# Altium project Stm32F407MCU.PrjPCB
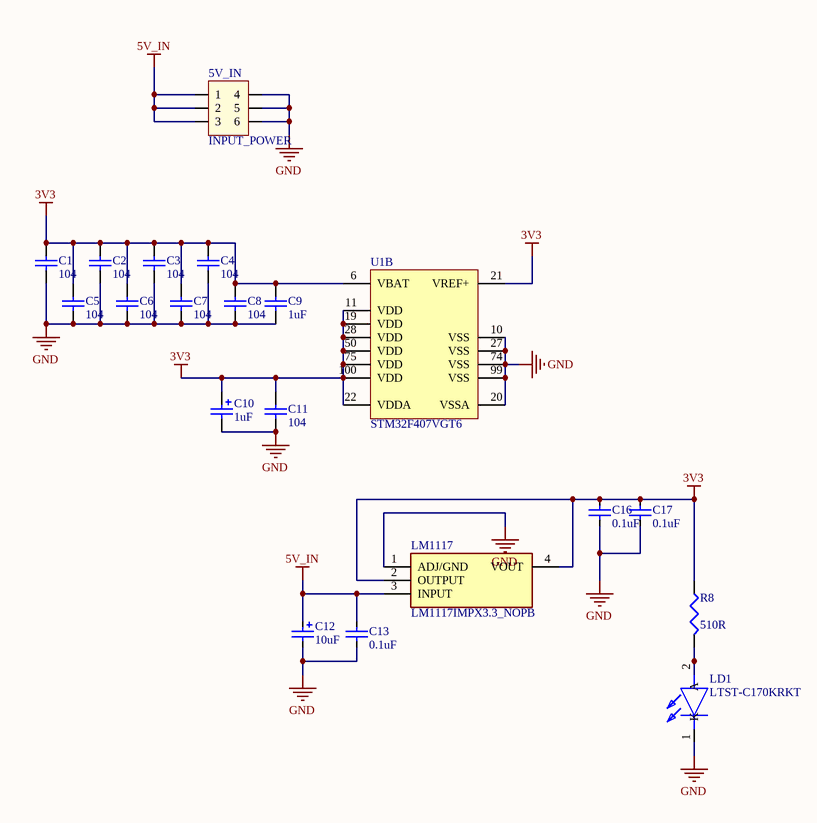
[diagram p0: power.SchDoc]
6 sheets, 67 parts. Net scope: global (net labels, ports and power ports of the same name join across sheets).
Board file: stm32f407_copter.PcbDoc
Sheets:
  power.SchDoc
  Pinout.SchDoc
  STM32F407VGT6.SchDoc
  user.SchDoc
  SENSORS.SchDoc
  design_note.SchDoc

## Sheet power.SchDoc
size A

### Parts
5V_IN  INPUT_POWER  [JP3x2]
C1  104  [CAPC2012X98N]
C2  104  [CAPC2012X98N]
C3  104  [CAPC2012X98N]
C4  104  [CAPC2012X98N]
C5  104  [CAPC2012X98N]
C6  104  [CAPC2012X98N]
C7  104  [CAPC2012X98N]
C8  104  [CAPC2012X98N]
C9  1uF  [CAPC1608X90N]
C10  1uF  [CAPPM3216X180N]
C11  104  [CAPC2012X98N]
C12  10uF  [CAPPM3528X210N]
C13  value 0.1uF  [CAPC3216X135N]  (hidden comment: Cap_0603)
C16  value 0.1uF  [CAPC3216X135N]  (hidden comment: Cap_0603)
C17  value 0.1uF  [CAPC3216X135N]  (hidden comment: Cap_0603)
LD1  LTST-C170KRKT  [LEDC2012X120N]
LM1117  LM1117IMPX3.3_NOPB  [SOT230P700X180-4N]
R8  value 510R  [RESC1608X55N]
U1  STM32F407VGT6  [STM-LQFP100_N]  (part B of 2)

### Nets
3V3: C1.1 C2.1 C3.1 C4.1 C5.1 C6.1 C7.1 C8.1 C9.2 C10.1 C11.1 C16.2 C17.2 LM1117.2(OUTPUT) LM1117.4(VOUT) R8.1 U1.6(VBAT) U1.11(VDD) U1.19(VDD) U1.21(VREF+) U1.22(VDDA) U1.28(VDD) U1.50(VDD) U1.75(VDD) U1.100(VDD)
5V_IN: 5V_IN.1 5V_IN.2 5V_IN.3 C12.1 C13.2 LM1117.3(INPUT)
GND: 5V_IN.4 5V_IN.5 5V_IN.6 C1.2 C2.2 C3.2 C4.2 C5.2 C6.2 C7.2 C8.2 C9.1 C10.2 C11.2 C12.2 C13.1 C16.1 C17.1 LD1.1(K) LM1117.1(ADJ/GND) U1.10(VSS) U1.20(VSSA) U1.27(VSS) U1.74(VSS) U1.99(VSS)
NetLD1_2: LD1.2(A) R8.2

### Library data of the parts
5V_IN = JP3x2: Connector 3x2; Value: Connector 3x2
C1 = Cap Semi: Capacitor (Semiconductor SIM Model); Component Code: C0805X104K5RAC3316; LatestRevisionDate: 17-Jul-2002; LatestRevisionNote: Re-released for DXP Platform.; PackageReference: C1206; Publisher: Altium Limited; Value: 104
C2-C8 C11 = Cap Semi: Capacitor (Semiconductor SIM Model); LatestRevisionDate: 17-Jul-2002; LatestRevisionNote: Re-released for DXP Platform.; PackageReference: C1206; Publisher: Altium Limited; Value: 104
C9 = Cap Semi: Capacitor (Semiconductor SIM Model); Value: 104; Component Code: CC0603KRX5R7BB105; LatestRevisionDate: 17-Jul-2002; LatestRevisionNote: Re-released for DXP Platform.; PackageReference: C1206; Publisher: Altium Limited
C10 = Cap Pol2: Polarized Capacitor (Axial); Published: 8-Jun-2000; LatestRevisionDate: 17-Jul-2002; LatestRevisionNote: Re-released for DXP Platform.; PackageReference: POLAR0.8; Publisher: Altium Limited; PackageDescription: Polarized Capacitor; 2 Leads; Value: 1uF
C12 = Cap_Tan_1210: Tantalum Capacitor; Value: 10uF
C13 C16 C17 = Cap_0603: Capacitor
LD1 = LTST-C171GKT: LED; Manufacturer_Name: Lite-On; Datasheet Link: https://media.digikey.com/pdf/Data%20Sheets/Lite-On%20PDFs/LTST-C171GKT.pdf; Height: 0.9mm; Manufacturer_Part_Number: LTST-C171GKT; Mouser Part Number: 859-LTST-C171GKT; Mouser Price/Stock: https://www.mouser.com/Search/Refine.aspx?Keyword=859-LTST-C171GKT; RS Part Number: 6920935P; RS Price/Stock: http://uk.rs-online.com/web/p/products/6920935P
LM1117 = LM1117IMPX3.3_NOPB: Integrated Circuit; Manufacturer_Name: Texas Instruments; Manufacturer_Part_Number: LM1117IMPX3.3/NOPB; Datasheet Link: http://www.ti.com/lit/ds/symlink/lm1117.pdf; Height: 1.8mm
R8 = Res3: Resistor; Published: 8-Jun-2000; LatestRevisionDate: 29-May-2009; LatestRevisionNote: IPC-7351 Footprint Added.; PackageReference: J1-0603; Publisher: Altium Limited; PackageDescription: Chip Resistor
U1 = STM32F407VGT6: ARM Cortex-M4 32-bit MCU+FPU, 210 DMIPS, 1024 kB Flash, 192 kB Internal RAM, 82 I/Os, 100-pin LQFP, -40 to 85 degC, Tray; Manufacturer: STMicroelectronics; D/A Converter: 2x12-bit; FLASH Size (Prog) (kB): 1024; I/Os (High Current): 82; Internal RAM Size (kB): 192; Operating Frequency(F) (Processor speed) (MHz): 168; Supply Voltage(Vcc) max (V): 3.6; Supply Voltage(Vcc) min (V): 1.8; DatasheetVersion: Rev. 4; PackageVersion: Rev. 1, 06/2013; PackageReference: LQFP100; PackageDescription: 100-Pin Low Profile Quad Flat Package, 14 x 14 mm Body, 0.5 mm Pitch; Supplier 1: Digi-Key; Supplier Part Number 1: 497-11605-ND; Supplier 2: Farnell; Supplier Part Number 2: 2064368; Supplier 3: Newark; Supplier Part Number 3: 73T2333; Supplier 4: Mouser; Supplier Part Number 4: 511-STM32F407VGT6; Core: ARM Cortex-M4; Packing: Tray; Mounting Technology: Surface Mount; PartNumber: STM32F407VGT6; ComponentLink1Description: Manufacturer URL; ComponentLink1URL: http://www.st.com/web/en/home.html; ComponentLink2Description: Datasheet; ComponentLink2URL: http://www.st.com/st-web-ui/static/active/en/resource/technical/document/datasheet/DM00037051.pdf; ComponentLink3Description: Package Specification; ComponentLink3URL: http://www.st.com/st-web-ui/static/active/en/resource/technical/document/data_brief/DM00071938.pdf

## Sheet Pinout.SchDoc
size A; PageSetup: Record=PageOptions|CenterHorizontal=True|CenterVertical=True|PrintScale=1.12|XCorrection=1.00|YCorrection=1.00|PrintKind=0|BorderSize=5000000|LeftOffset=0|BottomOffset=0|Orientation=2|PaperLength=1000|PaperWidth=1000|Scale=100|PaperSource=7|PrintQuality=-3|MediaType=1|DitherType=10|PrintScaleMode=1|PaperKind=Letter|PaperIndex=1
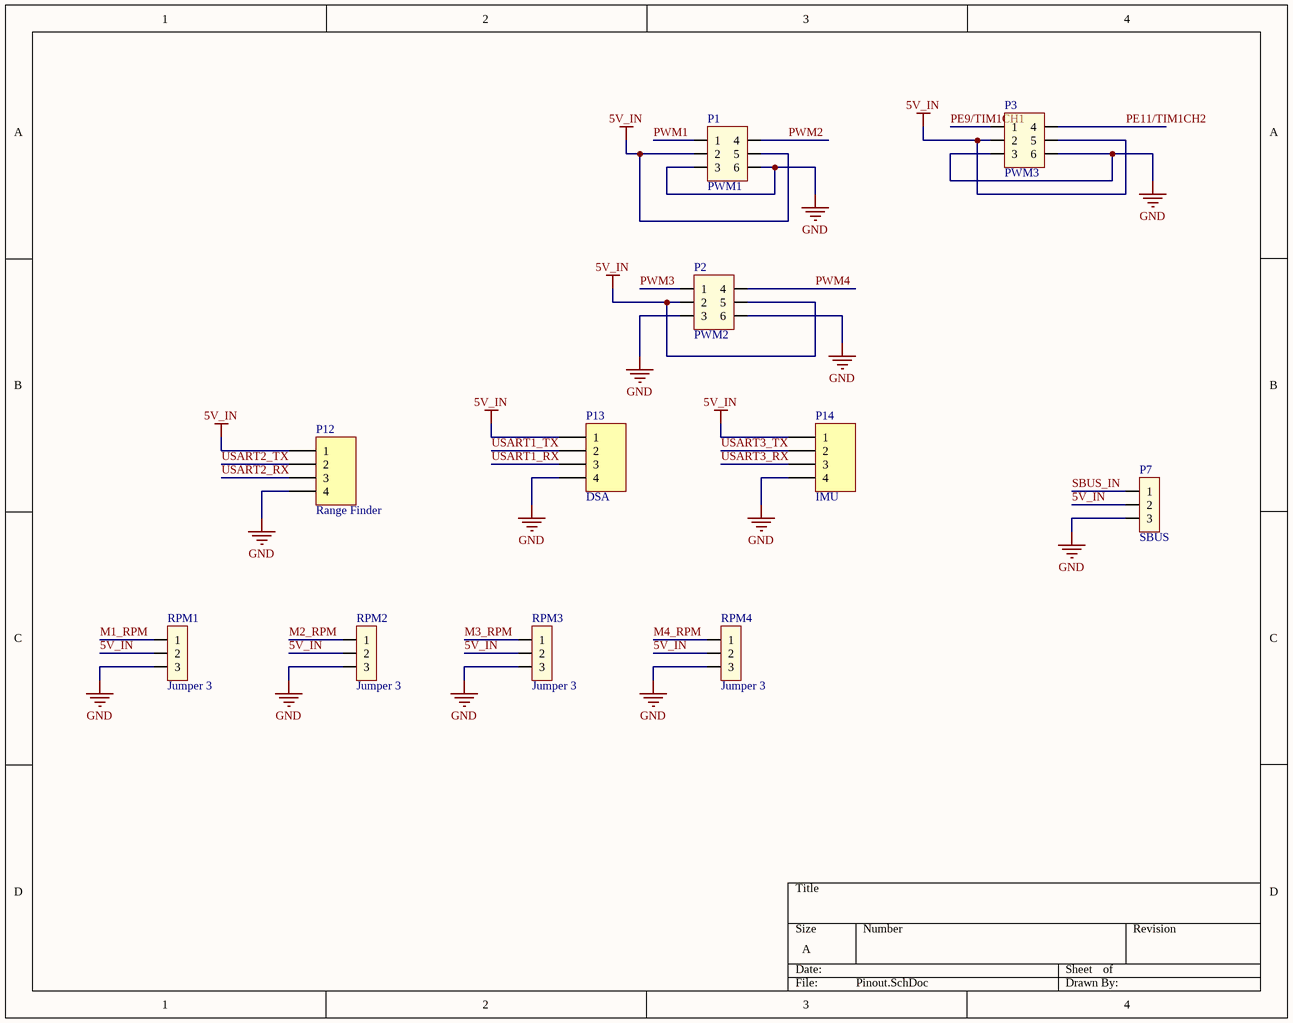
[diagram p1: Pinout.SchDoc]

### Parts
P1  PWM1  [JP3x2]
P2  PWM2  [JP3x2]
P3  PWM3  [JP3x2]
P7  SBUS  [JP3]
P12  Range Finder  [HDR1X4]
P13  DSA  [HDR1X4]
P14  IMU  [HDR1X4]
RPM1  Jumper 3  [JP3]
RPM2  Jumper 3  [JP3]
RPM3  Jumper 3  [JP3]
RPM4  Jumper 3  [JP3]

### Nets
5V_IN: P1.2 P1.5 P2.2 P2.5 P3.2 P3.5 P7.2 P12.1 P13.1 P14.1 RPM1.2 RPM2.2 RPM3.2 RPM4.2
GND: P1.3 P1.6 P2.3 P2.6 P3.3 P3.6 P7.3 P12.4 P13.4 P14.4 RPM1.3 RPM2.3 RPM3.3 RPM4.3
M1_RPM: RPM1.1
M2_RPM: RPM2.1
M3_RPM: RPM3.1
M4_RPM: RPM4.1
PE9/TIM1CH1: P3.1
PE11/TIM1CH2: P3.4
PWM1: P1.1
PWM2: P1.4
PWM3: P2.1
PWM4: P2.4
SBUS_IN: P7.1
USART1_RX: P13.3
USART1_TX: P13.2
USART2_RX: P12.3
USART2_TX: P12.2
USART3_RX: P14.3
USART3_TX: P14.2

### Library data of the parts
P1-P3 = JP3x2: Connector 3x2; Value: Connector 3x2
P7 = JP3: Jumper 3; Value: J3
P12-P14 = Header 4: Header, 4-Pin; LatestRevisionDate: 17-Jul-2002; LatestRevisionNote: Re-released for DXP Platform.; Publisher: Altium Limited
RPM1-RPM4 = JP3: Value: J3

## Sheet STM32F407VGT6.SchDoc
size A; PageSetup: Record=PageOptions|CenterHorizontal=True|CenterVertical=True|PrintScale=1.12|XCorrection=1.00|YCorrection=1.00|PrintKind=0|BorderSize=5000000|LeftOffset=0|BottomOffset=0|Orientation=2|PaperLength=1000|PaperWidth=1000|Scale=100|PaperSource=7|PrintQuality=-3|MediaType=1|DitherType=10|PrintScaleMode=1|PaperKind=Letter|PaperIndex=1
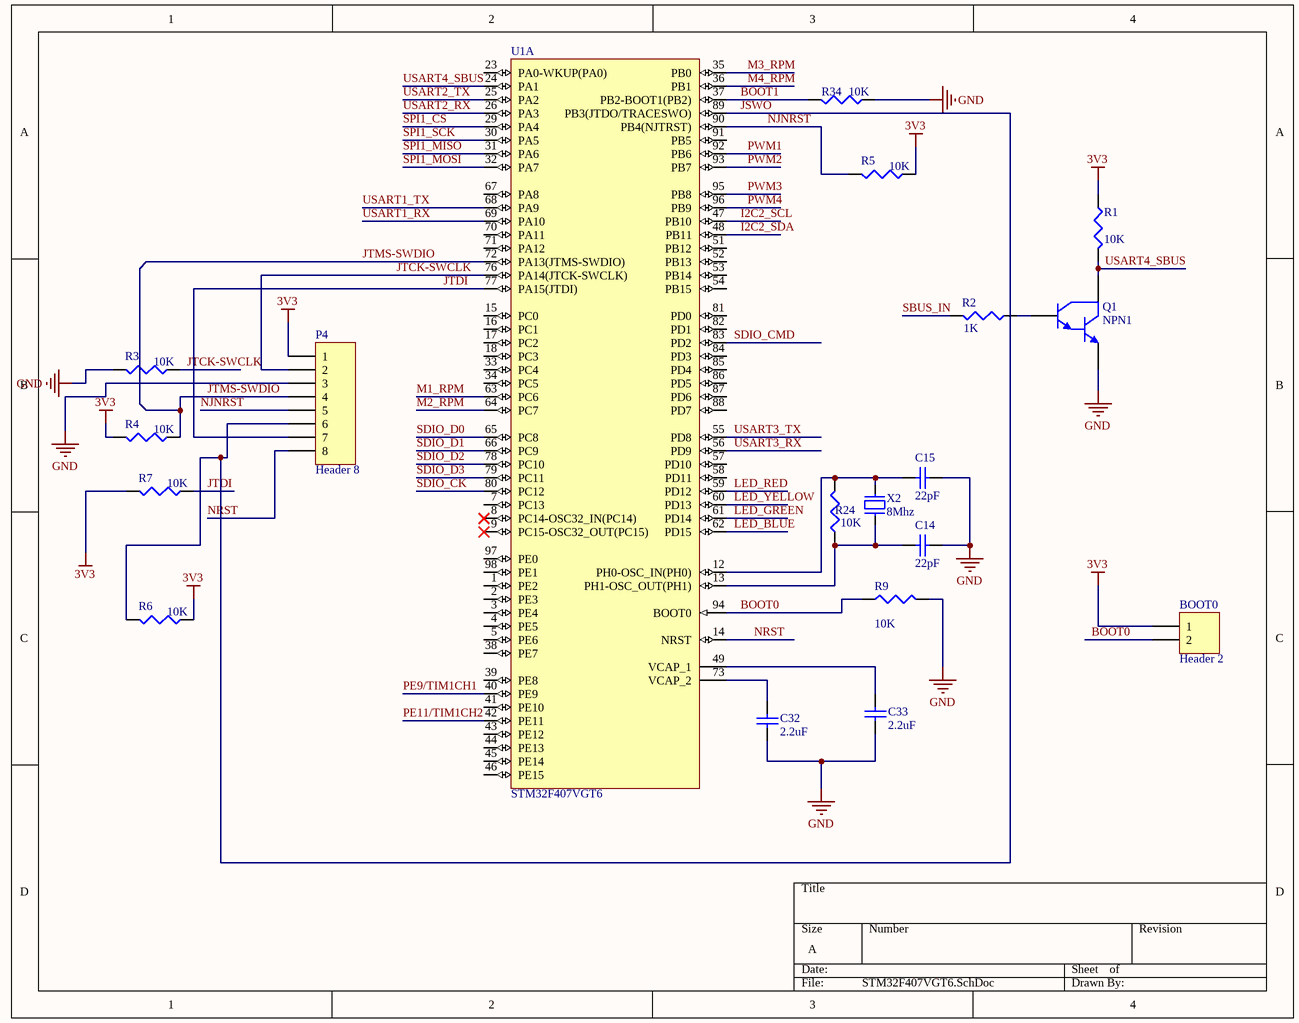
[diagram p2: STM32F407VGT6.SchDoc]

### Parts
BOOT0  Header 2  [HDR1X2]
C14  22pF  [CAPC1608X95N]
C15  22pF  [CAPC1608X95N]
C32  2.2uF  [CAPC3216X125N]
C33  2.2uF  [CAPC3216X125N]
P4  Header 8  [HDR1X8]
Q1  NPN1  [TO-92]
R1  value 10K  [RESC2012X60N]
R2  1K  [RESC2012X60N]
R3  value 10K  [RESC2012X60N]
R4  value 10K  [RESC2012X60N]
R5  value 10K  [RESC2012X60N]
R6  value 10K  [RESC2012X60N]
R7  value 10K  [RESC2012X60N]
R9  value 10K  [RESC2012X60N]
R24  value 10K  [RESC2012X60N]
R34  value 10K  [RESC2012X60N]
U1  STM32F407VGT6  [STM-LQFP100_N]  (part A of 2)
X2  8Mhz  [XT2]

### Nets
3V3: BOOT0.1 P4.1 R1.1 R4.2 R5.1 R6.1 R7.2
GND: C14.2 C15.2 C32.1 C33.1 P4.3 Q1.3(E) R3.2 R9.2 R34.1
BOOT0: BOOT0.2 R9.1 U1.94(BOOT0)
BOOT1: R34.2 U1.37(PB2-BOOT1(PB2))
I2C2_SCL: U1.47(PB10)
I2C2_SDA: U1.48(PB11)
JSWO: P4.6 R6.2 U1.89(PB3(JTDO/TRACESWO))
JTCK-SWCLK: P4.2 R3.1 U1.76(PA14(JTCK-SWCLK))
JTDI: P4.7 R7.1 U1.77(PA15(JTDI))
JTMS-SWDIO: P4.4 R4.1 U1.72(PA13(JTMS-SWDIO))
LED_BLUE: U1.62(PD15)
LED_GREEN: U1.61(PD14)
LED_RED: U1.59(PD12)
LED_YELLOW: U1.60(PD13)
M1_RPM: U1.63(PC6)
M2_RPM: U1.64(PC7)
M3_RPM: U1.35(PB0)
M4_RPM: U1.36(PB1)
NJNRST: P4.5 R5.2 U1.90(PB4(NJTRST))
NRST: P4.8 U1.14(NRST)
PE9/TIM1CH1: U1.40(PE9)
PE11/TIM1CH2: U1.42(PE11)
PWM1: U1.92(PB6)
PWM2: U1.93(PB7)
PWM3: U1.95(PB8)
PWM4: U1.96(PB9)
SBUS_IN: R2.2
SDIO_CK: U1.80(PC12)
SDIO_CMD: U1.83(PD2)
SDIO_D0: U1.65(PC8)
SDIO_D1: U1.66(PC9)
SDIO_D2: U1.78(PC10)
SDIO_D3: U1.79(PC11)
SPI1_CS: U1.29(PA4)
SPI1_MISO: U1.31(PA6)
SPI1_MOSI: U1.32(PA7)
SPI1_SCK: U1.30(PA5)
USART1_RX: U1.69(PA10)
USART1_TX: U1.68(PA9)
USART2_RX: U1.26(PA3)
USART2_TX: U1.25(PA2)
USART3_RX: U1.56(PD9)
USART3_TX: U1.55(PD8)
USART4_SBUS: Q1.1(C) R1.2 U1.24(PA1)
NetC14_1: C14.1 R24.1 U1.13(PH1-OSC_OUT(PH1)) X2.2
NetC15_1: C15.1 R24.2 U1.12(PH0-OSC_IN(PH0)) X2.1
NetC32_2: C32.2 U1.73(VCAP_2)
NetC33_2: C33.2 U1.49(VCAP_1)
NetQ1_2: Q1.2(B) R2.1

Not connected (* = marked no-connect by the designer): U1 1(PE2) 2(PE3) 3(PE4) 4(PE5) 5(PE6) 7(PC13) 8(PC14-OSC32_IN(PC14))* 9(PC15-OSC32_OUT(PC15))* 15(PC0) 16(PC1) 17(PC2) 18(PC3) 23(PA0-WKUP(PA0)) 33(PC4) 34(PC5) 38(PE7) 39(PE8) 41(PE10) 43(PE12) 44(PE13) 45(PE14) 46(PE15) 51(PB12) 52(PB13) 53(PB14) 54(PB15) 57(PD10) 58(PD11) 67(PA8) 70(PA11) 71(PA12) 81(PD0) 82(PD1) 84(PD3) 85(PD4) 86(PD5) 87(PD6) 88(PD7) 91(PB5) 97(PE0) 98(PE1)

### Library data of the parts
BOOT0 = Header 2: Header, 2-Pin; LatestRevisionDate: 17-Jul-2002; LatestRevisionNote: Re-released for DXP Platform.; Publisher: Altium Limited
C14 C15 C32 C33 = Cap Semi: Capacitor (Semiconductor SIM Model); Value: 104; LatestRevisionDate: 17-Jul-2002; LatestRevisionNote: Re-released for DXP Platform.; PackageReference: C1206; Publisher: Altium Limited
P4 = Header 8: Header, 8-Pin; LatestRevisionDate: 17-Jul-2002; LatestRevisionNote: Re-released for DXP Platform.; Publisher: Altium Limited
Q1 = NPN1: NPN Darlington Bipolar Transistor; Published: 8-Jun-2000; LatestRevisionDate: 17-Jul-2002; LatestRevisionNote: Re-released for DXP Platform.; DatasheetVersion: 1989; PackageVersion: 1989; PackageReference: TO-92; Publisher: Altium Limited; PackageDescription: TO, Flat Index; 3 In-Line, Axial Leads; Body Dia. 4.6mm; Leads 0.41 x 0.39 mm (max); Code_JEDEC: TO-92
R1-R7 R9 R24 R34 = Res3: Resistor; Published: 8-Jun-2000; LatestRevisionDate: 29-May-2009; LatestRevisionNote: IPC-7351 Footprint Added.; PackageReference: J1-0603; Publisher: Altium Limited; PackageDescription: Chip Resistor
  R2: Value: 1K
U1 = STM32F407VGT6: as U1 on sheet power; DatasheetVersion: Rev. 4; PackageVersion: Rev. 1, 06/2013; PackageReference: LQFP100; PackageDescription: 100-Pin Low Profile Quad Flat Package, 14 x 14 mm Body, 0.5 mm Pitch; Supplier 1: Digi-Key; Supplier Part Number 1: 497-11605-ND; Supplier 2: Farnell; Supplier Part Number 2: 2064368; Supplier 3: Newark; Supplier Part Number 3: 73T2333; Supplier 4: Mouser; Supplier Part Number 4: 511-STM32F407VGT6; Core: ARM Cortex-M4; Packing: Tray; Mounting Technology: Surface Mount; PartNumber: STM32F407VGT6; ComponentLink1Description: Manufacturer URL; ComponentLink1URL: http://www.st.com/web/en/home.html; ComponentLink2Description: Datasheet; ComponentLink2URL: http://www.st.com/st-web-ui/static/active/en/resource/technical/document/datasheet/DM00037051.pdf; ComponentLink3Description: Package Specification; ComponentLink3URL: http://www.st.com/st-web-ui/static/active/en/resource/technical/document/data_brief/DM00071938.pdf
X2 = XT2: Crystal For all Crystal 2pin.; Value: 4Mhz

## Sheet user.SchDoc
size A; PageSetup: Record=PageOptions|CenterHorizontal=True|CenterVertical=True|PrintScale=1.12|XCorrection=1.00|YCorrection=1.00|PrintKind=0|BorderSize=5000000|LeftOffset=0|BottomOffset=0|Orientation=2|PaperLength=1000|PaperWidth=1000|Scale=100|PaperSource=7|PrintQuality=-3|MediaType=1|DitherType=10|PrintScaleMode=1|PaperKind=Letter|PaperIndex=1
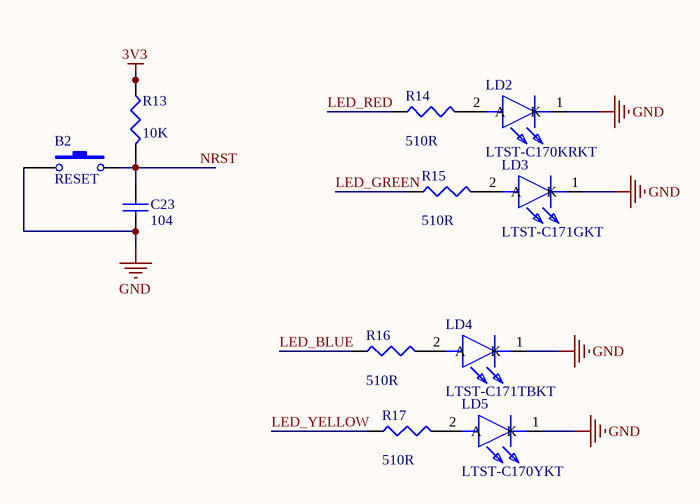
[diagram p3: user.SchDoc]

### Parts
B2  RESET  [3-1825910-5]
C23  104  [CAPC2012X98N]
LD2  LTST-C170KRKT  [LEDC2012X120N]
LD3  LTST-C171GKT  [LEDC2012X90N]
LD4  LTST-C171TBKT  [LEDC2012X90N]
LD5  LTST-C170YKT  [LEDC2012X120N]
R13  value 10K  [RESC2012X60N]
R14  value 510R  [RESC1608X55N]
R15  value 510R  [RESC1608X55N]
R16  value 510R  [RESC1608X55N]
R17  value 510R  [RESC1608X55N]

### Nets
3V3: R13.1
GND: B2.1 C23.2 LD2.1(K) LD3.1(K) LD4.1(K) LD5.1(K)
LED_BLUE: R16.1
LED_GREEN: R15.1
LED_RED: R14.1
LED_YELLOW: R17.1
NRST: B2.2 C23.1 R13.2
NetLD2_2: LD2.2(A) R14.2
NetLD3_2: LD3.2(A) R15.2
NetLD4_2: LD4.2(A) R16.2
NetLD5_2: LD5.2(A) R17.2

### Library data of the parts
B2 = SW-PB: Switch; Published: 24-Mar-1999; LatestRevisionDate: 17-Jul-2002; LatestRevisionNote: Re-released for DXP Platform.; PackageReference: SPST-2; Publisher: Altium Limited; PackageDescription: Switch; 2 Leads
C23 = Cap Semi: Capacitor (Semiconductor SIM Model); LatestRevisionDate: 17-Jul-2002; LatestRevisionNote: Re-released for DXP Platform.; PackageReference: C1206; Publisher: Altium Limited; Value: 104
LD2-LD5 = LTST-C171GKT: LED; Manufacturer_Name: Lite-On; Datasheet Link: https://media.digikey.com/pdf/Data%20Sheets/Lite-On%20PDFs/LTST-C171GKT.pdf; Height: 0.9mm; Manufacturer_Part_Number: LTST-C171GKT; Mouser Part Number: 859-LTST-C171GKT; Mouser Price/Stock: https://www.mouser.com/Search/Refine.aspx?Keyword=859-LTST-C171GKT; RS Part Number: 6920935P; RS Price/Stock: http://uk.rs-online.com/web/p/products/6920935P
R13-R17 = Res3: Resistor; Published: 8-Jun-2000; LatestRevisionDate: 29-May-2009; LatestRevisionNote: IPC-7351 Footprint Added.; PackageReference: J1-0603; Publisher: Altium Limited; PackageDescription: Chip Resistor

## Sheet SENSORS.SchDoc
size A
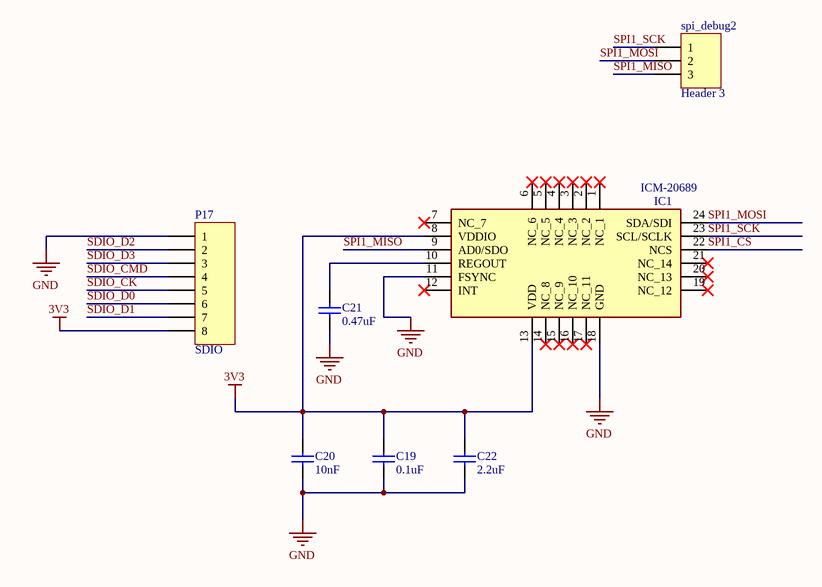
[diagram p4: SENSORS.SchDoc]

### Parts
C19  0.1uF  [CAPC2012X145N]
C20  10nF  [CAPC2012X145N]
C21  0.47uF  [CAPC1608X90N]
C22  2.2uF  [CAPC3216X125N]
IC1  ICM-20689  [ICM20689]
P17  SDIO  [HDR1X8]
spi_debug2  Header 3  [HDR1X3]

### Nets
3V3: C19.1 C20.1 C22.2 IC1.8(VDDIO) IC1.13(VDD) P17.8
GND: C19.2 C20.2 C21.1 C22.1 IC1.11(FSYNC) IC1.18(GND) P17.1
SDIO_CK: P17.5
SDIO_CMD: P17.4
SDIO_D0: P17.6
SDIO_D1: P17.7
SDIO_D2: P17.2
SDIO_D3: P17.3
SPI1_CS: IC1.22(NCS)
SPI1_MISO: IC1.9(AD0/SDO) spi_debug2.3
SPI1_MOSI: IC1.24(SDA/SDI) spi_debug2.2
SPI1_SCK: IC1.23(SCL/SCLK) spi_debug2.1
NetC21_2: C21.2 IC1.10(REGOUT)

Not connected (* = marked no-connect by the designer): IC1 1(NC_1)* 2(NC_2)* 3(NC_3)* 4(NC_4)* 5(NC_5)* 6(NC_6)* 7(NC_7)* 12(INT)* 14(NC_8)* 15(NC_9)* 16(NC_10)* 17(NC_11)* 19(NC_12)* 20(NC_13)* 21(NC_14)*

### Library data of the parts
C19 C21 C22 = Cap Semi: as C14 on sheet STM32F407VGT6; LatestRevisionDate: 17-Jul-2002; LatestRevisionNote: Re-released for DXP Platform.; PackageReference: C1206; Publisher: Altium Limited
C20 = Cap Semi: Capacitor (Semiconductor SIM Model); Value: 104; Component Code: VJ0805Y103KNAAO; LatestRevisionDate: 17-Jul-2002; LatestRevisionNote: Re-released for DXP Platform.; PackageReference: C1206; Publisher: Altium Limited
IC1 = ICM-20689: Integrated Circuit; Manufacturer_Name: InvenSense Inc.; Datasheet Link: http://www.invensense.com/wp-content/uploads/2017/08/ICM-20689-v2.2-002.pdf; Height: 1mm; Manufacturer_Part_Number: ICM-20689; Mouser Part Number: 410-ICM-20689; Mouser Price/Stock: https://www.mouser.com/Search/Refine.aspx?Keyword=410-ICM-20689
P17 = Header 8: Header, 8-Pin; LatestRevisionDate: 17-Jul-2002; LatestRevisionNote: Re-released for DXP Platform.; Publisher: Altium Limited
spi_debug2 = Header 3: Header, 3-Pin; LatestRevisionDate: 17-Jul-2002; LatestRevisionNote: Re-released for DXP Platform.; Publisher: Altium Limited

## Sheet design_note.SchDoc
size A
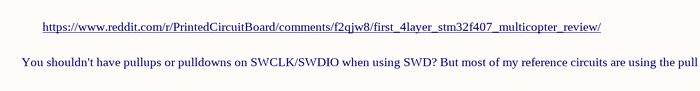
[diagram p5: design_note.SchDoc]

### Notes on the sheet
- You shouldn't have pullups or pulldowns on SWCLK/SWDIO when using SWD? But most of my reference circuits are using the pull resistors
- https://www.reddit.com/r/PrintedCircuitBoard/comments/f2qjw8/first_4layer_stm32f407_multicopter_review/

## Nets that join several sheets
3V3: power (25 pins), STM32F407VGT6 (7 pins), user (R13.1), SENSORS (6 pins)
5V_IN: power (6 pins), Pinout (14 pins)
GND: power (25 pins), Pinout (14 pins), STM32F407VGT6 (9 pins), user (6 pins), SENSORS (7 pins)
LED_BLUE: STM32F407VGT6 (U1.62), user (R16.1)
LED_GREEN: STM32F407VGT6 (U1.61), user (R15.1)
LED_RED: STM32F407VGT6 (U1.59), user (R14.1)
LED_YELLOW: STM32F407VGT6 (U1.60), user (R17.1)
M1_RPM: Pinout (RPM1.1), STM32F407VGT6 (U1.63)
M2_RPM: Pinout (RPM2.1), STM32F407VGT6 (U1.64)
M3_RPM: Pinout (RPM3.1), STM32F407VGT6 (U1.35)
M4_RPM: Pinout (RPM4.1), STM32F407VGT6 (U1.36)
NRST: STM32F407VGT6 (P4.8 U1.14), user (B2.2 C23.1 R13.2)
PE9/TIM1CH1: Pinout (P3.1), STM32F407VGT6 (U1.40)
PE11/TIM1CH2: Pinout (P3.4), STM32F407VGT6 (U1.42)
PWM1: Pinout (P1.1), STM32F407VGT6 (U1.92)
PWM2: Pinout (P1.4), STM32F407VGT6 (U1.93)
PWM3: Pinout (P2.1), STM32F407VGT6 (U1.95)
PWM4: Pinout (P2.4), STM32F407VGT6 (U1.96)
SBUS_IN: Pinout (P7.1), STM32F407VGT6 (R2.2)
SDIO_CK: STM32F407VGT6 (U1.80), SENSORS (P17.5)
SDIO_CMD: STM32F407VGT6 (U1.83), SENSORS (P17.4)
SDIO_D0: STM32F407VGT6 (U1.65), SENSORS (P17.6)
SDIO_D1: STM32F407VGT6 (U1.66), SENSORS (P17.7)
SDIO_D2: STM32F407VGT6 (U1.78), SENSORS (P17.2)
SDIO_D3: STM32F407VGT6 (U1.79), SENSORS (P17.3)
SPI1_CS: STM32F407VGT6 (U1.29), SENSORS (IC1.22)
SPI1_MISO: STM32F407VGT6 (U1.31), SENSORS (IC1.9 spi_debug2.3)
SPI1_MOSI: STM32F407VGT6 (U1.32), SENSORS (IC1.24 spi_debug2.2)
SPI1_SCK: STM32F407VGT6 (U1.30), SENSORS (IC1.23 spi_debug2.1)
USART1_RX: Pinout (P13.3), STM32F407VGT6 (U1.69)
USART1_TX: Pinout (P13.2), STM32F407VGT6 (U1.68)
USART2_RX: Pinout (P12.3), STM32F407VGT6 (U1.26)
USART2_TX: Pinout (P12.2), STM32F407VGT6 (U1.25)
USART3_RX: Pinout (P14.3), STM32F407VGT6 (U1.56)
USART3_TX: Pinout (P14.2), STM32F407VGT6 (U1.55)